# EAGLE design cheapskate_display_3 (EAGLE 5.02)
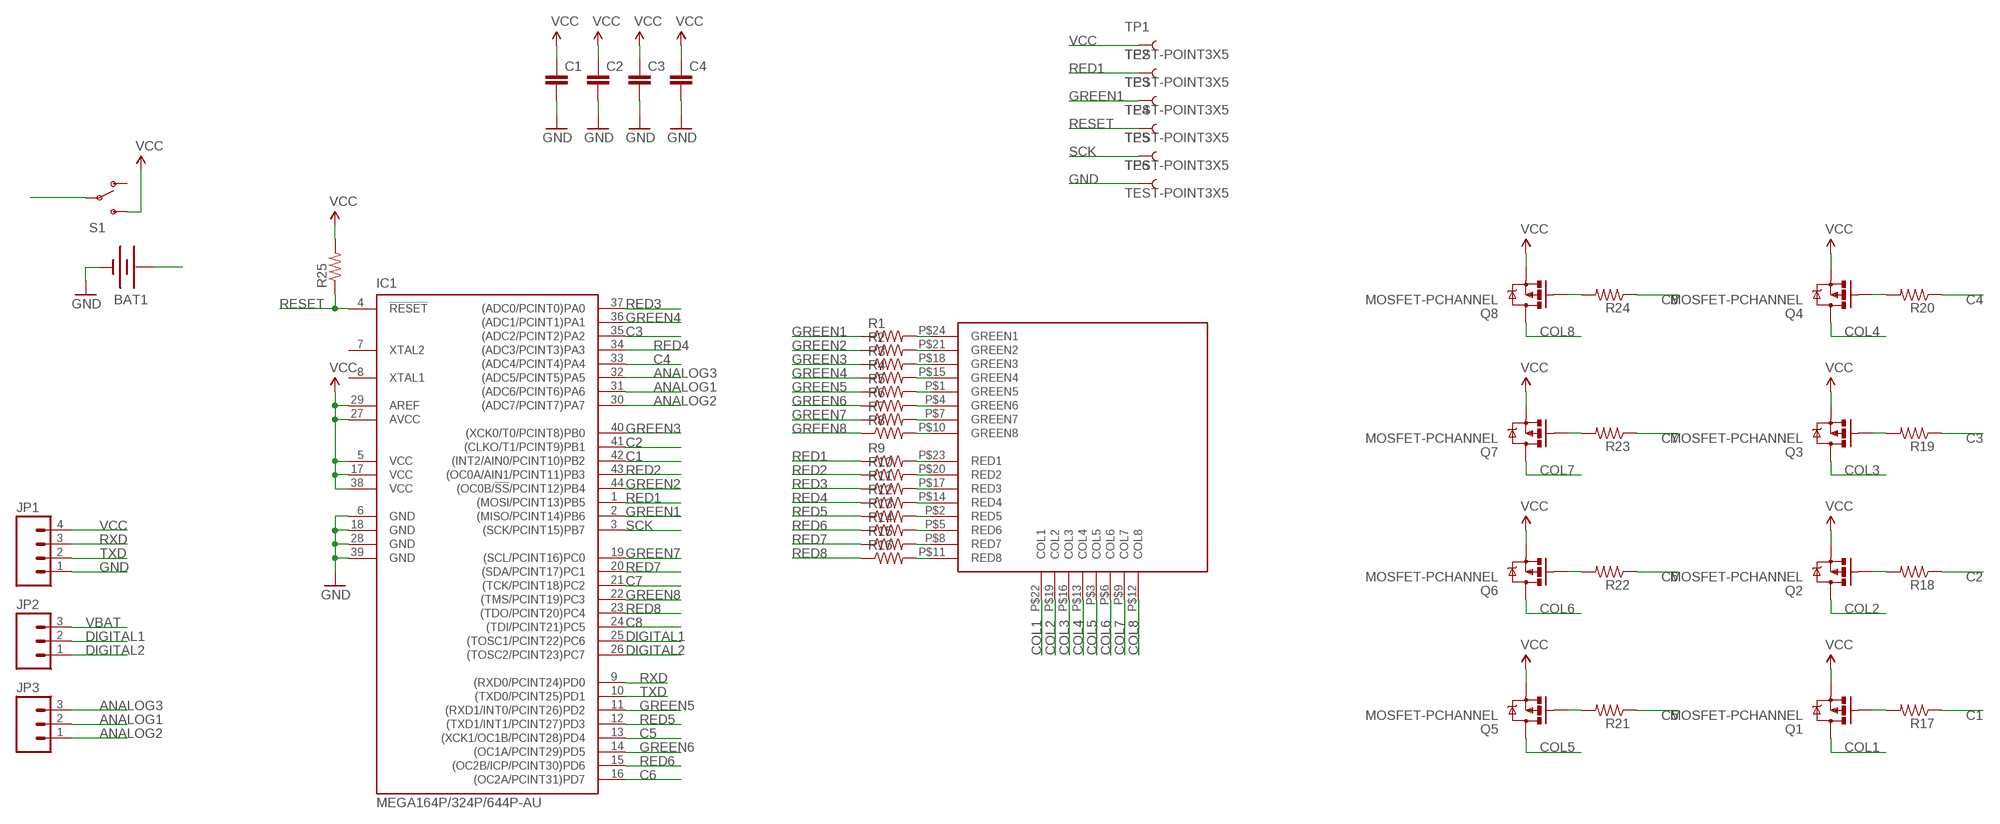
[diagram p0: schematic, sheet 1]

## Parts
BAT1  BATTERY  [MATTCON_20MM_PTH]
C1  CAP0603  [0603]
C2  CAP0603  [0603]
C3  CAP0603  [0603]
C4  CAP0603  [0603]
IC1  MEGA164P/324P/644P-AU  [TQFP44]
JP1  M04PTH  [1X04]
JP2  M03PTH  [1X03]
JP3  M03PTH  [1X03]
Q1  MOSFET-PCHANNEL  [SOT23]
Q2  MOSFET-PCHANNEL  [SOT23]
Q3  MOSFET-PCHANNEL  [SOT23]
Q4  MOSFET-PCHANNEL  [SOT23]
Q5  MOSFET-PCHANNEL  [SOT23]
Q6  MOSFET-PCHANNEL  [SOT23]
Q7  MOSFET-PCHANNEL  [SOT23]
Q8  MOSFET-PCHANNEL  [SOT23]
R1  RESISTOR0603  [0603]
R2  RESISTOR0603  [0603]
R3  RESISTOR0603  [0603]
R4  RESISTOR0603  [0603]
R5  RESISTOR0603  [0603]
R6  RESISTOR0603  [0603]
R7  RESISTOR0603  [0603]
R8  RESISTOR0603  [0603]
R9  RESISTOR0603  [0603]
R10  RESISTOR0603  [0603]
R11  RESISTOR0603  [0603]
R12  RESISTOR0603  [0603]
R13  RESISTOR0603  [0603]
R14  RESISTOR0603  [0603]
R15  RESISTOR0603  [0603]
R16  RESISTOR0603  [0603]
R17  RESISTOR0603  [0603]
R18  RESISTOR0603  [0603]
R19  RESISTOR0603  [0603]
R20  RESISTOR0603  [0603]
R21  RESISTOR0603  [0603]
R22  RESISTOR0603  [0603]
R23  RESISTOR0603  [0603]
R24  RESISTOR0603  [0603]
R25  RESISTOR0603  [0603]
S1  SWITCH-SPSTSMD2  [SWITCH-SPDT-SMD]
TP1  TEST-POINT3X5  [PAD.03X.05]
TP2  TEST-POINT3X5  [PAD.03X.05]
TP3  TEST-POINT3X5  [PAD.03X.05]
TP4  TEST-POINT3X5  [PAD.03X.05]
TP5  TEST-POINT3X5  [PAD.03X.05]
TP6  TEST-POINT3X5  [PAD.03X.05]
U$1  FYM-1228AXX  [FYM-12881ABXX]

## Nets
ANALOG1: IC1.31((ADC6/PCINT6)PA6) JP3.2
ANALOG2: IC1.30((ADC7/PCINT7)PA7) JP3.1
ANALOG3: IC1.32((ADC5/PCINT5)PA5) JP3.3
C1: IC1.42((INT2/AIN0/PCINT10)PB2) R17.1
C2: IC1.41((CLKO/T1/PCINT9)PB1) R18.1
C3: IC1.35((ADC2/PCINT2)PA2) R19.1
C4: IC1.33((ADC4/PCINT4)PA4) R20.1
C5: IC1.13((XCK1/OC1B/PCINT28)PD4) R21.1
C6: IC1.16((OC2A/PCINT31)PD7) R22.1
C7: IC1.21((TCK/PCINT18)PC2) R23.1
C8: IC1.24((TDI/PCINT21)PC5) R24.1
COL1: Q1.3(D) U$1.P$22(COL1)
COL2: Q2.3(D) U$1.P$19(COL2)
COL3: Q3.3(D) U$1.P$16(COL3)
COL4: Q4.3(D) U$1.P$13(COL4)
COL5: Q5.3(D) U$1.P$3(COL5)
COL6: Q6.3(D) U$1.P$6(COL6)
COL7: Q7.3(D) U$1.P$9(COL7)
COL8: Q8.3(D) U$1.P$12(COL8)
DIGITAL1: IC1.25((TOSC1/PCINT22)PC6) JP2.2
DIGITAL2: IC1.26((TOSC2/PCINT23)PC7) JP2.1
GND: BAT1.3(-) C1.2 C2.2 C3.2 C4.2 IC1.6(GND) IC1.18(GND) IC1.28(GND) IC1.39(GND) JP1.1 TP6.P$1
GREEN1: IC1.2((MISO/PCINT14)PB6) R1.1 TP3.P$1
GREEN2: IC1.44((OC0B/!SS!/PCINT12)PB4) R2.1
GREEN3: IC1.40((XCK0/T0/PCINT8)PB0) R3.1
GREEN4: IC1.36((ADC1/PCINT1)PA1) R4.1
GREEN5: IC1.11((RXD1/INT0/PCINT26)PD2) R5.1
GREEN6: IC1.14((OC1A/PCINT29)PD5) R6.1
GREEN7: IC1.19((SCL/PCINT16)PC0) R7.1
GREEN8: IC1.22((TMS/PCINT19)PC3) R8.1
N$1: Q1.1(G) R17.2
N$2: R1.2 U$1.P$24(GREEN1)
N$3: Q2.1(G) R18.2
N$4: R2.2 U$1.P$21(GREEN2)
N$5: Q3.1(G) R19.2
N$6: R3.2 U$1.P$18(GREEN3)
N$7: Q4.1(G) R20.2
N$8: R4.2 U$1.P$15(GREEN4)
N$9: Q5.1(G) R21.2
N$10: R5.2 U$1.P$1(GREEN5)
N$11: Q6.1(G) R22.2
N$12: R6.2 U$1.P$4(GREEN6)
N$13: Q7.1(G) R23.2
N$14: R7.2 U$1.P$7(GREEN7)
N$15: Q8.1(G) R24.2
N$16: R8.2 U$1.P$10(GREEN8)
N$17: R9.2 U$1.P$23(RED1)
N$18: R10.2 U$1.P$20(RED2)
N$19: R11.2 U$1.P$17(RED3)
N$20: R12.2 U$1.P$14(RED4)
N$21: R13.2 U$1.P$2(RED5)
N$22: R14.2 U$1.P$5(RED6)
N$23: R15.2 U$1.P$8(RED7)
N$24: R16.2 U$1.P$11(RED8)
RED1: IC1.1((MOSI/PCINT13)PB5) R9.1 TP2.P$1
RED2: IC1.43((OC0A/AIN1/PCINT11)PB3) R10.1
RED3: IC1.37((ADC0/PCINT0)PA0) R11.1
RED4: IC1.34((ADC3/PCINT3)PA3) R12.1
RED5: IC1.12((TXD1/INT1/PCINT27)PD3) R13.1
RED6: IC1.15((OC2B/ICP/PCINT30)PD6) R14.1
RED7: IC1.20((SDA/PCINT17)PC1) R15.1
RED8: IC1.23((TDO/PCINT20)PC4) R16.1
RESET: IC1.4(!RESET) R25.1 TP4.P$1
RXD: IC1.9((RXD0/PCINT24)PD0) JP1.3
SCK: IC1.3((SCK/PCINT15)PB7) TP5.P$1
TXD: IC1.10((TXD0/PCINT25)PD1) JP1.2
VBAT: BAT1.2(+) JP2.3 S1.2(P)
VCC: C1.1 C2.1 C3.1 C4.1 IC1.5(VCC) IC1.17(VCC) IC1.27(AVCC) IC1.29(AREF) IC1.38(VCC) JP1.4 Q1.2(S) Q2.2(S) Q3.2(S) Q4.2(S) Q5.2(S) Q6.2(S) Q7.2(S) Q8.2(S) R25.2 S1.3(S) TP1.P$1
Unconnected: IC1.7(XTAL2) IC1.8(XTAL1) S1.1(O)

## Library data of the parts
BAT1 = john:BATTERY: Battery Holders Various common sizes : AA, AAA, 20mm coin cell and 12mm coin cell.
C1-C4 = SparkFun:CAP: Capacitor Standard 0603 ceramic capacitor, and 0.1" leaded capacitor.
IC1 = avr-5:MEGA164P/324P/644P-AU
JP1 = SparkFun:M04: Header 4 Standard 4-pin 0.1" header. Use with straight break away headers (SKU : PRT-00116), right angle break away headers (PRT-00553), swiss pins (PRT-00743), machine pins (PRT-00117), and female headers (PRT-00115). Molex polarized connector foot print use with SKU : PRT-08231 with associated crimp pins and housings.
JP2 JP3 = SparkFun:M03: Header 3 Standard 3-pin 0.1" header. Use with straight break away headers (SKU : PRT-00116), right angle break away headers (PRT-00553), swiss pins (PRT-00743), machine pins (PRT-00117), and female headers (PRT-00115). Molex polarized connector foot print use with SKU : PRT-08232 with associated crimp pins and housings.
Q1-Q8 = SparkFun:MOSFET-PCHANNEL
R1-R25 = SparkFun:RESISTOR: Resistor Basic schematic elements and footprints for 0603, 1206, and PTH 1/10th watt (small) resistors.
S1 = SparkFun:SWITCH-SPST: SPST Switch Simple slide switch. Spark Fun Electronics SKU : COM-00102
TP1-TP6 = SparkFun:TEST-POINT
U$1 = john:FYM-1228AXX

## Board
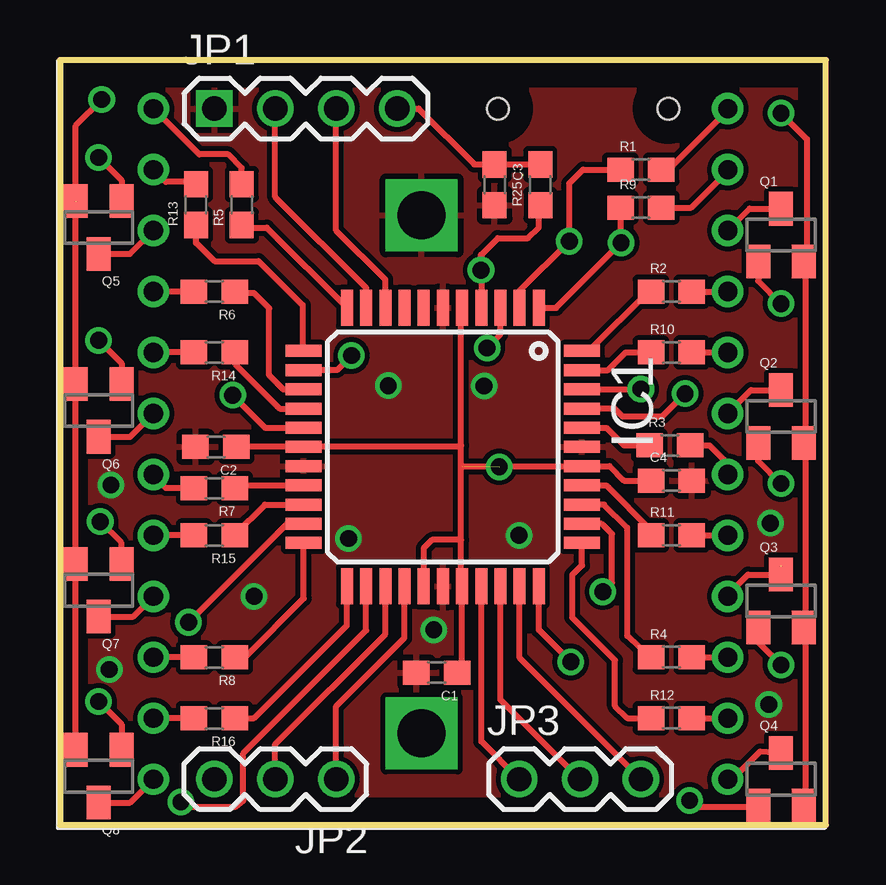
[diagram p1: board, top side]
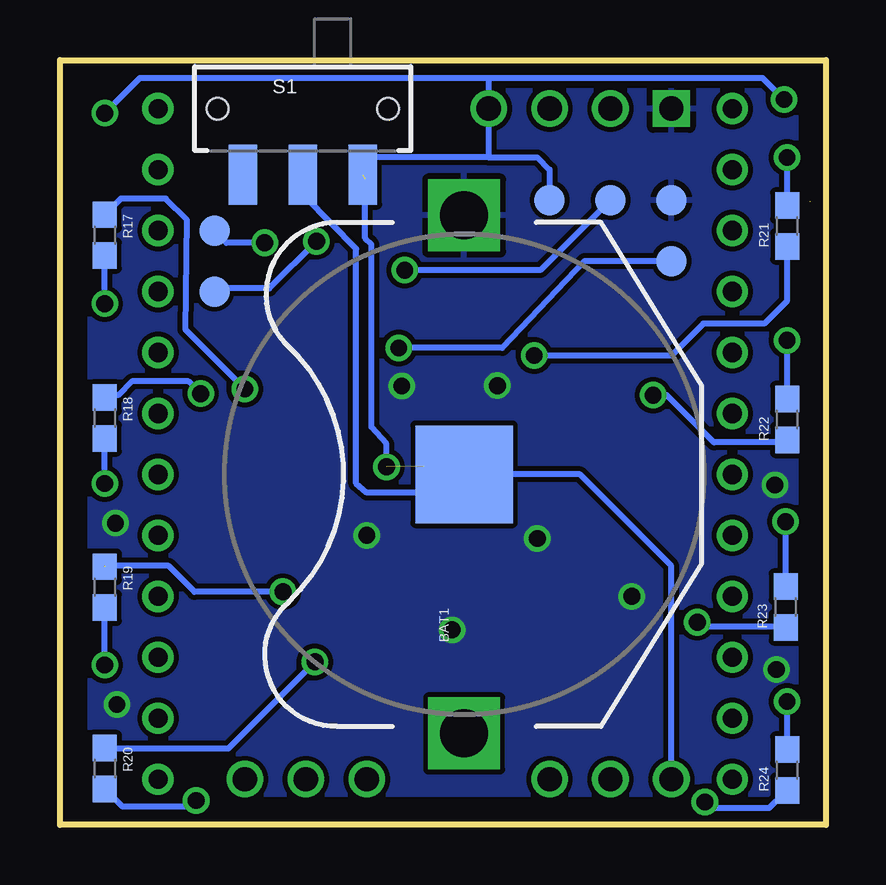
[diagram p2: board, bottom side, seen from below]

Size 31.93 x 31.87 mm. Coordinates in mm from the lower left corner, seen from the top.
Outline: 0,0 31.93,0 31.93,31.87 0,31.87 0,0
Copper layers (1*16): Top 0.035mm / dielectric 1.5mm / Bottom 0.035mm
Design rules "default": minimum track width 10mil, minimum drill 24mil, track to track 8mil, track to pad 8mil, pad to pad 8mil, via to via 8mil, smd to smd 8mil, copper to edge 40mil, drill to drill 8mil, minimum pad ring 10mil, minimum via ring 8mil, stop-mask expansion 4mil, vias tented up to drill 0mil, thermal gap 10mil

### Footprints (pad centres in the part's own frame; a part is rotated, then mirrored left to right if it is on the bottom)
MATTCON_20MM_PTH = drill 2 square: 1 -10.795,0; 3 10.795,0 | smd 4.064 x 4.064: 2 0,0
0603 = smd 1.1 x 1: 1 -0.85,0; 2 0.85,0
TQFP44 = smd 1.5 x 0.5: 1 -5.8,4; 2 -5.8,3.2; 3 -5.8,2.4; 4 -5.8,1.6; 5 -5.8,0.8; 6 -5.8,0; 7 -5.8,-0.8; 8 -5.8,-1.6; 9 -5.8,-2.4; 10 -5.8,-3.2; 11 -5.8,-4; 23 5.8,-4; 24 5.8,-3.2; 25 5.8,-2.4; 26 5.8,-1.6; 27 5.8,-0.8; 28 5.8,0; 29 5.8,0.8; 30 5.8,1.6; 31 5.8,2.4; 32 5.8,3.2; 33 5.8,4 | smd 0.5 x 1.5: 12 -4,-5.8; 13 -3.2,-5.8; 14 -2.4,-5.8; 15 -1.6,-5.8; 16 -0.8,-5.8; 17 0,-5.8; 18 0.8,-5.8; 19 1.6,-5.8; 20 2.4,-5.8; 21 3.2,-5.8; 22 4,-5.8; 34 4,5.8; 35 3.2,5.8; 36 2.4,5.8; 37 1.6,5.8; 38 0.8,5.8; 39 0,5.8; 40 -0.8,5.8; 41 -1.6,5.8; 42 -2.4,5.8; 43 -3.2,5.8; 44 -4,5.8
1X04 = drill 1.016 square: 1 0,0 | drill 1.016 round: 2 2.54,0; 3 5.08,0; 4 7.62,0
1X03 = drill 1.016 round: 1 0,0; 2 2.54,0; 3 5.08,0
SOT23 = smd 1 x 1.4: 1 -0.95,-1.1; 2 0.95,-1.1; 3 0,1.1
SWITCH-SPDT-SMD = smd 1.2 x 2.5: 1 -2.5,-2.75; 2 0,-2.75; 3 2.5,-2.75 | hole 0.9: -3.55,0; 3.55,0
PAD.03X.05 = smd 1.27 x 1.27: P$1 0,0
FYM-12881ABXX = drill 0.8 round: P$1 0,0; P$2 0,-2.54; P$3 0,-5.08; P$4 0,-7.62; P$5 0,-10.16; P$6 0,-12.7; P$7 0,-15.24; P$8 0,-17.78; P$9 0,-20.32; P$10 0,-22.86; P$11 0,-25.4; P$12 0,-27.94; P$13 23.94,-27.94; P$14 23.94,-25.4; P$15 23.94,-22.86; P$16 23.94,-20.32; P$17 23.94,-17.78; P$18 23.94,-15.24; P$19 23.94,-12.7; P$20 23.94,-10.16; P$21 23.94,-7.62; P$22 23.94,-5.08; P$23 23.94,-2.54; P$24 23.94,0

### Placement (x,y rotation side)
BAT1  15.07,14.6 90 bottom
C1  15.71,6.35 180 top
C2  6.5,15.74 180 top
C3  18.12,26.66 270 top
C4  25.49,14.35 0 top
IC1  15.96,15.74 270 top
JP1  6.44,29.84 0 top
JP2  11.52,1.9 180 top
JP3  19.14,1.9 0 top
Q1  30.06,24.57 0 top
Q2  30.06,17.01 0 top
Q3  30.06,9.33 0 top
Q4  30.06,1.9 0 top
Q5  1.61,24.89 180 top
Q6  1.61,17.27 180 top
Q7  1.61,9.77 180 top
Q8  1.61,2.03 180 top
R1  24.22,27.3 0 top
R2  25.49,22.22 0 top
R3  25.43,15.81 0 top
R4  25.49,6.98 0 top
R5  7.58,25.84 90 top
R6  6.44,22.22 180 top
R7  6.44,14.03 180 top
R8  6.44,6.98 180 top
R9  24.22,25.71 0 top
R10  25.49,19.68 0 top
R11  25.49,12.06 0 top
R12  25.49,4.44 0 top
R13  5.68,25.84 90 top
R14  6.44,19.68 180 top
R15  6.44,12.06 180 top
R16  6.44,4.44 180 top
R17  30.06,24.57 270 bottom
R18  30.06,16.95 270 bottom
R19  30.06,9.9 270 bottom
R20  30.06,2.34 270 bottom
R21  1.61,24.95 90 bottom
R22  1.61,16.89 90 bottom
R23  1.68,9.08 90 bottom
R24  1.61,2.28 90 bottom
R25  20.03,26.66 90 top
S1  21.81,29.84 0 bottom
TP1  11.52,26.03 0 bottom
TP2  25.49,24.76 0 bottom
TP3  25.49,22.22 0 bottom
TP4  8.98,26.03 0 bottom
TP5  6.44,23.49 0 bottom
TP6  6.44,26.03 0 bottom
U$1  3.9,29.84 0 top

### Tracks (layer width: path | path; a pad name or v marks a point on that pad's centre or on a via)
ANALOG1
  Top 0.254: IC1.31 18.36,5.22 JP3.2
ANALOG2
  Top 0.254: IC1.30 17.56,3.48 JP3.1
ANALOG3
  Top 0.254: IC1.32 19.16,6.96 JP3.3
C1  (via drill 0.7)
  Top 0.254: IC1.42 21.78,18.16 v24.22,18.16
  Bottom 0.254: R17.1 29.39,26.09 27.52,26.09 26.63,25.2 26.7,20.63 v24.22,18.16
C2  (via drill 0.7)
  Top 0.254: IC1.41 23.13,17.34 23.46,17.01 25.11,17.01 v26.06,17.96
  Bottom 0.254: v26.06,17.96 26.57,18.47 28.92,18.47 29.49,17.9 30,17.9 30,17.86 R18.1
C3  (via drill 0.7)  (1 unrouted)
  Top 0.254: IC1.35 22.59,12.54 23.01,12.12 23.01,10.09 v22.63,9.71
  Bottom 0.254: v22.63,9.71 26.31,9.71 27.39,10.79 30.06,10.79
C4  (via drill 0.7)
  Top 0.254: IC1.33 19.96,8.12 v21.3,6.79
  Bottom 0.254: v21.3,6.79 24.92,3.17 29.81,3.17 30.12,2.85 30.09,2.81 R20.1
C5  (via drill 0.7)
  Top 0.254: IC1.13 11.54,18.94 v12.15,19.55
  Bottom 0.254: v12.15,19.55 6.44,19.55 5.11,20.89 2.57,20.89 1.61,21.84 R21.1 1.61,24.12
C6  (via drill 0.7)
  Top 0.254: IC1.16 8.56,16.54 v7.2,17.9
  Bottom 0.254: v7.2,17.9 6.63,17.9 4.66,15.93 1.61,15.93 R22.1
C7  (via drill 0.7)
  Top 0.254: IC1.21 9.46,12.54 v5.36,8.44
  Bottom 0.254: 1.65,8.25 1.61,8.25 | R23.1 1.65,8.25 | v5.36,8.44 5.17,8.25 1.65,8.25
C8  (via drill 0.7)
  Top 0.254: IC1.24 12.76,8.1 7.65,2.98 7.65,1.01 7.33,0.76 5.3,0.76 v5.04,0.95
  Bottom 0.254: R24.1 1.59,1.43 1.55,1.39 2.12,0.95 2.25,0.82 2.38,0.69 4.79,0.69 v5.04,0.95
COL1
  Top 0.254: U$1.P$22 | Q1.3 28.75,25.67 U$1.P$22
COL2
  Top 0.254: U$1.P$19 | Q2.3 28.81,18.11 U$1.P$19
COL3
  Top 0.254: 27.84,9.58 | U$1.P$16 27.84,9.58 | Q3.3 28.68,10.43 27.84,9.58
COL4
  Top 0.254: U$1.P$13 28.03,1.9 29.19,3.06 Q4.3
COL5
  Top 0.254: Q5.3 2.93,23.79 U$1.P$3
COL6
  Top 0.254: Q6.3 2.93,16.17 U$1.P$6
COL7
  Top 0.254: Q7.3 3.05,8.67 U$1.P$9
COL8
  Top 0.254: Q8.3 2.93,0.93 U$1.P$12
DIGITAL1
  Top 0.254: IC1.25 13.56,7.95 8.98,3.36 JP2.2
DIGITAL2
  Top 0.254: IC1.26 14.36,7.79 11.52,4.95 JP2.1
GND  (via drill 0.7)
  other vias: 12.03,11.93 17.68,18.28 13.69,18.3 15.58,8.12 19.14,12.06 2.12,14.16 2.06,6.47 8.09,9.52 29.62,12.57 29.55,5.01
  pour Top: -0.04,31.87 -0.04,-0.13 31.84,-0.13 31.84,31.87
  pour Bottom: 0.09,31.87 31.58,31.87 31.58,0.12 0.09,0.12
GREEN1  (via drill 0.7)
  Top 0.254: IC1.2 19.16,22.25 v21.23,24.32 21.23,26.73 21.81,27.3 23.46,27.3 | 23.46,27.3 R1.1 | 23.46,27.3 23.52,27.36
  Bottom 0.254: TP3.P$1 25.49,22.35 23.2,22.35 v21.23,24.32
GREEN2
  Top 0.254: R2.1 24.64,22.24 24.6,22.28 22.06,19.74 IC1.44
GREEN3
  Top 0.254: IC1.40 22.78,16.54 23.52,15.81 R3.1
GREEN4
  Top 0.254: IC1.36 22.68,13.34 23.65,12.38 23.65,7.87 24.64,6.94 | 24.64,6.94 24.66,6.92 | 24.64,6.94 R4.1
GREEN5
  Top 0.254: R5.1 7.68,24.89 8.62,24.89 IC1.11
GREEN6
  Top 0.254: IC1.14 9.31,18.14 8.73,18.73 8.73,21.52 8.09,22.16 7.33,22.16 7.29,22.2 R6.1
GREEN7
  Top 0.254: R7.1 7.29,14.07 7.26,14.09 7.32,14.14 IC1.19
GREEN8
  Top 0.254: R8.1 7.71,6.98 10.16,9.43 IC1.22
N$1  (via drill 0.7)
  Top 0.254: 29.07,23.47 29.04,23.49 | Q1.1 29.07,23.47 | 29.07,23.47 29.11,23.43 29.11,22.66 v30.06,21.71
  Bottom 0.254: 30.06,23.74 R17.2 v30.06,21.71
N$2
  Top 0.254: U$1.P$24 27.84,29.78 25.36,27.3 R1.2
N$3  (via drill 0.7)
  Top 0.254: Q2.1 29.11,15.17 v30.06,14.22
  Bottom 0.254: v30.06,14.22 R18.2
N$4
  Top 0.254: 26.31,22.22 R2.2 U$1.P$21
N$5  (via drill 0.7)
  Top 0.254: 29.07,8.23 29.04,8.25 | 29.07,8.23 Q3.1 29.11,7.61 v30.06,6.66 | 29.07,8.23 29.11,8.19
  Bottom 0.254: v30.06,6.66 R19.2
N$6
  Top 0.254: U$1.P$18 27.84,15.04 27.08,15.81 R3.2
N$7  (via drill 0.7)
  Top 0.254: Q4.1 29.11,0.86 29.11,0.76 26.5,0.76 v26.25,1.01
  Bottom 0.254: R20.2 29.32,0.76 26.5,0.76 v26.25,1.01
N$8
  Top 0.254: R4.2 U$1.P$15
N$9  (via drill 0.7)
  Top 0.254: Q5.1 2.56,26.86 v1.61,27.81
  Bottom 0.254: R21.2 v1.61,27.81
N$10
  Top 0.254: U$1.P$1 5.8,27.93 7.01,27.93 7.58,27.36 R5.2
N$11  (via drill 0.7)
  Top 0.254: Q6.1 2.56,19.24 v1.61,20.19
  Bottom 0.254: 1.61,17.71 R22.2 v1.61,20.19
N$12
  Top 0.254: R6.2 U$1.P$4
N$13  (via drill 0.7)
  Top 0.254: 2.54,10.87 2.5,10.92 | 2.54,10.87 Q7.1 | 2.54,10.87 2.54,11.76 v1.68,12.63
  Bottom 0.254: 1.68,9.9 R23.2 v1.68,12.63
N$14
  Top 0.254: U$1.P$7 3.9,14.54 4.41,14.03 R7.2
N$15  (via drill 0.7)
  Top 0.254: Q8.1 2.56,4.19 v1.61,5.14
  Bottom 0.254: R24.2 v1.61,5.14
N$16
  Top 0.254: R8.2 U$1.P$10
N$17
  Top 0.254: U$1.P$23 27.84,27.24 26.31,25.71 R9.2
N$18
  Top 0.254: 26.31,19.68 R10.2 U$1.P$20
N$19
  Top 0.254: R11.2 U$1.P$17
N$20
  Top 0.254: R12.2 U$1.P$14
N$21
  Top 0.254: R13.2 5.74,26.75 5.74,26.79 4.41,26.79 U$1.P$2
N$22
  Top 0.254: R14.2 5.59,19.7 5.55,19.74 5.49,19.68 U$1.P$5
N$23
  Top 0.254: U$1.P$8 3.9,12.12 3.96,12.06 R15.2
N$24
  Top 0.254: R16.2 U$1.P$11
RED1  (via drill 0.7)
  Top 0.254: IC1.1 20.68,21.54 v23.39,24.25 23.39,25.71 R9.1
  Bottom 0.254: v23.39,24.25 24.98,24.25 TP2.P$1
RED2
  Top 0.254: IC1.43 22.85,18.94 23.58,19.68 R10.1 24.73,19.68
RED3
  Top 0.254: R11.1 24.64,12.27 22.77,14.14 IC1.37
RED4
  Top 0.254: IC1.34 21.76,10.81 21.36,10.41 21.36,8.63 23.14,6.85 23.14,4.95 23.65,4.44 R12.1
RED5
  Top 0.254: R13.1 5.68,24.25 6.44,23.49 8.28,23.49 10.12,21.65 10.12,19.74 IC1.12
RED6
  Top 0.254: IC1.15 9.16,17.34 7.33,19.17 7.33,19.62 7.29,19.66 R14.1
RED7
  Top 0.254: R15.1 7.29,12.08 8.55,13.34 IC1.20
RED8
  Top 0.254: IC1.23 11.96,8.31 8.09,4.44 R16.1
RESET  (via drill 0.7)
  Top 0.254: 17.56,23.76 IC1.4 | 17.56,23.76 18.25,24.44 19.52,24.44 19.96,24.89 19.96,25.78 20,25.81 R25.1 | 17.55,23.05 v17.55,23.11 17.55,23.74 17.56,23.76
  Bottom 0.254: TP4.P$1 11.9,23.11 v17.55,23.11 17.61,23.11
RXD
  Top 0.254: IC1.9 13.56,22.71 11.52,24.76 JP1.3
SCK  (via drill 0.7)
  Top 0.254: IC1.3 18.36,20.43 v17.8,19.87
  Bottom 0.254: v17.8,19.87 13.49,19.87 10.06,23.49 TP5.P$1 6.38,23.55
TXD
  Top 0.254: IC1.10 12.76,22.37 8.98,26.16 JP1.2
VBAT
  Bottom 0.254: JP2.3 6.44,10.79 10.25,14.6 BAT1.2 15.96,13.84 19.14,13.84 19.58,14.22 19.58,24 21.68,26.16 21.68,27.22 | 21.68,27.22 21.68,27.3 | 21.68,27.22 S1.2
VCC  (via drill 0.7)  (3 unrouted)
  Top 0.254: C1.1 16.81,6.51 16.76,6.56 IC1.29 16.73,9.98 16.73,11.87 | C3.1 17.27,27.52 14.95,29.84 JP1.4 | C3.1 18.1,27.52 18,27.3 | C3.1 R25.2 | 0.66,10.79 Q7.2 | 0.66,10.79 Q6.2 0.66,18.28 | 0.66,10.79 0.6,10.79 | 0.66,18.28 Q5.2 | 0.66,18.28 0.6,18.28 | Q8.2 0.66,3.17 | 0.66,3.17 0.66,10.79 | 0.66,3.17 0.72,3.17 | 30.97,8.23 30.95,8.25 | 30.97,8.23 Q3.2 31.01,8.44 31.08,8.5 31.08,15.93 | Q4.2 31.01,0.94 31.08,1.01 31.07,8.19 30.97,8.23 | 30.97,15.91 30.95,15.93 | 30.97,15.91 Q2.2 31.03,15.93 31.08,15.93 | 31.08,15.93 31.08,16 31.07,15.87 30.97,15.91 | 31.01,23.43 31.14,23.3 31.14,28.57 v30.06,29.65 | Q1.2 30.97,23.47 31.01,23.43 | 0.66,25.97 0.66,29.14 v1.74,30.22 | 24.79,14.35 C4.1 | 24.79,14.35 23.52,14.35 22.92,14.94 IC1.38 16.75,14.94 16.73,14.92 | 24.79,14.35 24.85,14.41 | C2.1 7.35,15.77 7.39,15.81 7.45,15.74 IC1.17 16.66,15.74 16.73,15.81 | 31.01,23.43 31.08,23.36 31.08,15.93 | IC1.5 16.73,21.59 16.73,15.81 | 16.73,11.87 16.73,14.92 | 16.73,14.92 16.73,15.81 | IC1.27 15.16,11.51 15.52,11.87 16.73,11.87
  Bottom 0.254: 14.06,27.81 19.14,27.81 19.32,27.12 S1.3 | 14.06,27.81 12.03,27.81 11.52,27.3 TP1.P$1 | 14.06,27.81 JP1.4 14.06,31.11 | v1.74,30.22 2.63,31.11 14.06,31.11 | v30.06,29.65 28.6,31.11 14.06,31.11 | 19.2,26.92 19.2,24.44 18.95,24.19 18.95,16.57 18.31,15.87 v18.31,14.92